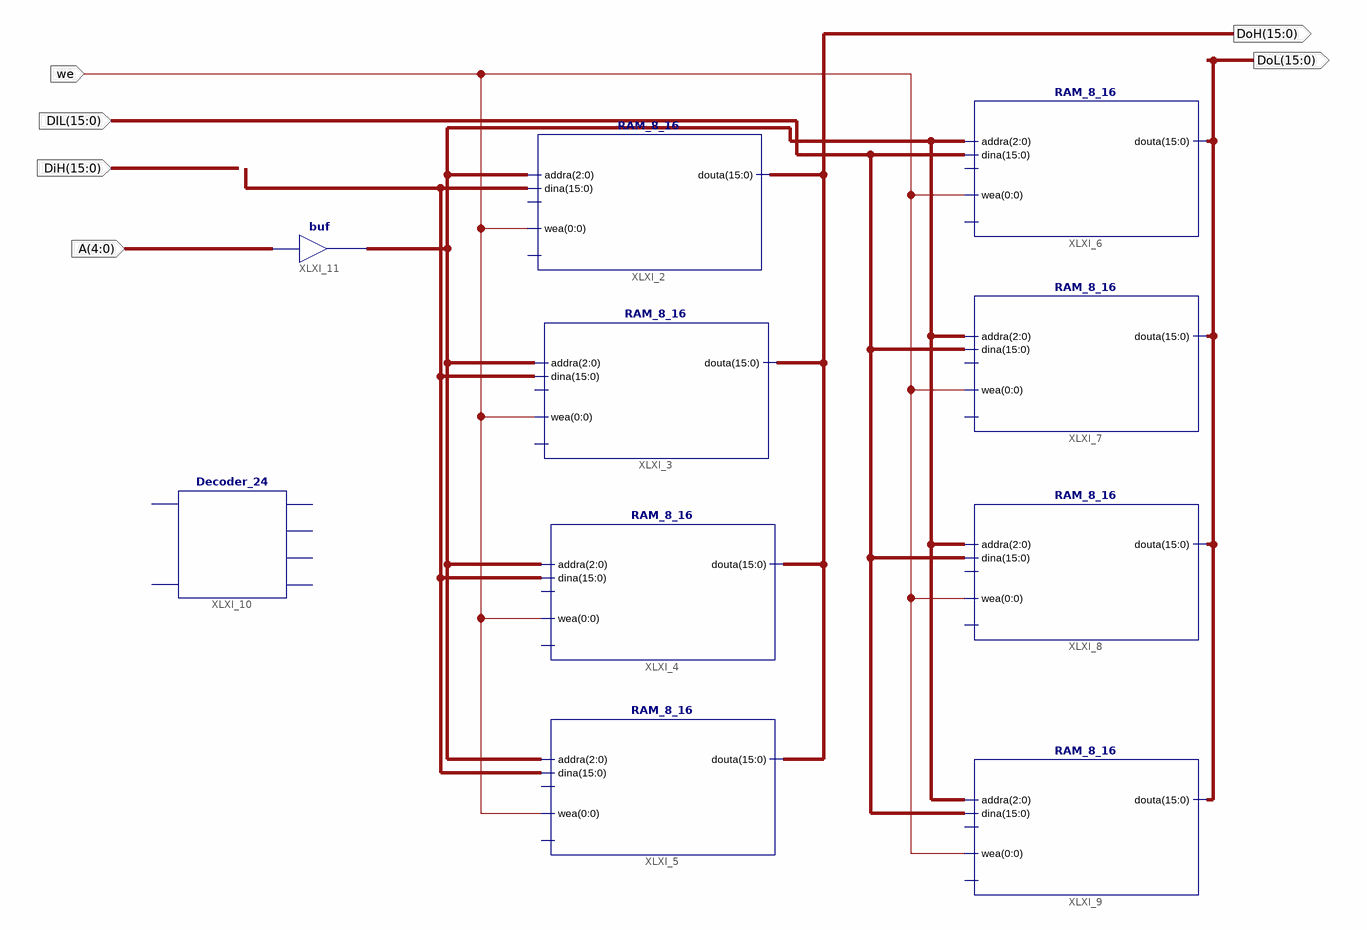
[diagram p0: schematic sheet 1]
// Xilinx ISE schematic RAM_zxd.sch (kintex7) as structural Verilog: 10 symbols, 6 ports
module RAM_zxd (
  input  [15:0] DIL,
  input  [15:0] DiH,
  input  [4:0] A,
  input  we,
  output [15:0] DoL,
  output [15:0] DoH
);

  wire [2:0] XLXN_29;
  wire [15:0] XLXN_7;

  RAM_8_16 XLXI_2 (.addra(XLXN_29), .dina(XLXN_7), .wea(we), .douta(DoH));  // open: ena, clka
  RAM_8_16 XLXI_3 (.addra(XLXN_29), .dina(XLXN_7), .wea(we), .douta(DoH));  // open: ena, clka
  RAM_8_16 XLXI_4 (.addra(XLXN_29), .dina(XLXN_7), .wea(we), .douta(DoH));  // open: ena, clka
  RAM_8_16 XLXI_5 (.addra(XLXN_29), .dina(XLXN_7), .wea(we), .douta(DoH));  // open: ena, clka
  RAM_8_16 XLXI_6 (.addra(XLXN_29), .dina(DIL), .wea(we), .douta(DoL));  // open: ena, clka
  RAM_8_16 XLXI_7 (.addra(XLXN_29), .dina(DIL), .wea(we), .douta(DoL));  // open: ena, clka
  RAM_8_16 XLXI_8 (.addra(XLXN_29), .dina(DIL), .wea(we), .douta(DoL));  // open: ena, clka
  RAM_8_16 XLXI_9 (.addra(XLXN_29), .dina(DIL), .wea(we), .douta(DoL));  // open: ena, clka
  Decoder_24 XLXI_10 ();  // open: B, A, D0, D1, D3, D2
  assign XLXN_29 = A;  // buf XLXI_11, 5 bits wide
endmodule
